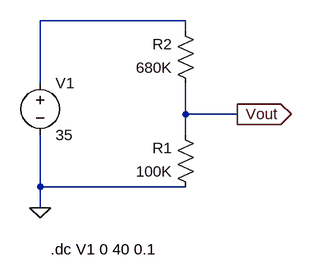
[diagram p0: schematic input-v-measure.asc]
input-v-measure.asc, the LTspice schematic file:
Version 4
SHEET 1 880 680
WIRE 144 0 -80 0
WIRE 144 16 144 0
WIRE -80 96 -80 0
WIRE 144 144 144 96
WIRE 224 144 144 144
WIRE 144 176 144 144
WIRE -80 256 -80 176
WIRE 144 256 -80 256
WIRE -80 288 -80 256
FLAG 224 144 Vout
IOPIN 224 144 Out
FLAG -80 288 0
SYMBOL voltage -80 80 R0
SYMATTR InstName V1
SYMATTR Value 35
SYMBOL res 160 272 R180
WINDOW 0 36 76 Left 2
WINDOW 3 36 40 Left 2
SYMATTR InstName R1
SYMATTR Value 100K
SYMBOL res 160 112 R180
WINDOW 0 36 76 Left 2
WINDOW 3 36 40 Left 2
SYMATTR InstName R2
SYMATTR Value 680K
TEXT -64 352 Left 2 !.dc V1 0 40 0.1

The netlist it stands for:
* input-v-measure.asc
V1 N001 0 35
R1 0 Vout 100K
R2 Vout N001 680K
.dc V1 0 40 0.1
.backanno
.end

* Results of the author's LTspice run, read from the files saved beside the schematic
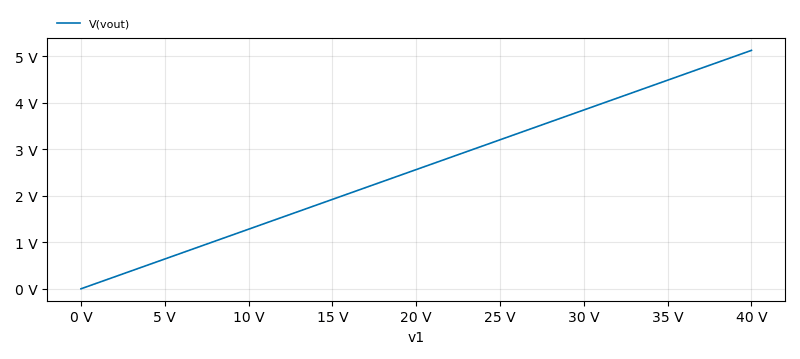
[diagram p1: DC transfer characteristic of input-v-measure.asc, plotted from the saved traces]
* DC transfer characteristic, 1 run:
*   V(vout): 0 V at v1=0 V, 5.128 V at v1=40 V, min 0 V, max 5.128 V